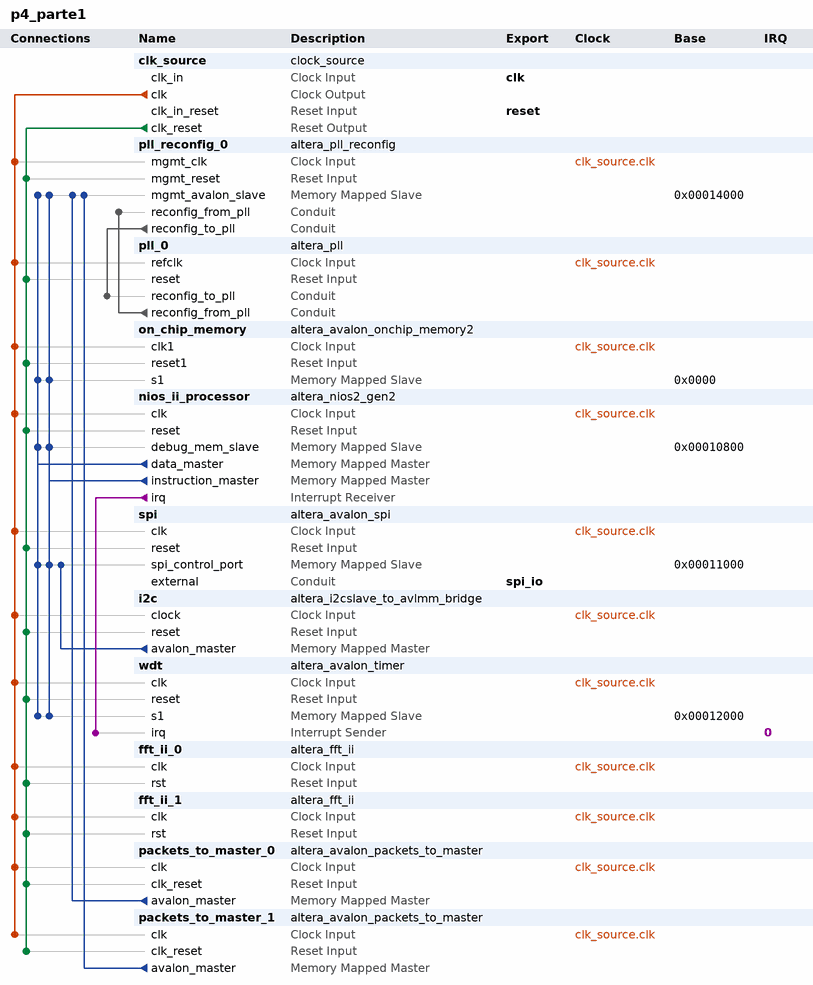
[diagram p0: system contents]
# Platform Designer (Qsys) system p4_parte1, Cyclone V 5CSEMA5F31C6
# Parameters at their usual value, and those the tool derives, are not listed.
package require -exact qsys 16.0
create_system p4_parte1
set_project_property DEVICE_FAMILY {Cyclone V}
set_project_property DEVICE 5CSEMA5F31C6

add_instance clk_source clock_source 16.0
set_instance_parameter_value clk_source clockFrequency 50000000

add_instance pll_reconfig_0 altera_pll_reconfig 16.0

add_instance pll_0 altera_pll 16.0
set_instance_parameter_value pll_0 gui_actual_phase_shift0 {0 ps}
set_instance_parameter_value pll_0 gui_device_speed_grade 1
set_instance_parameter_value pll_0 gui_dsm_out_sel 2nd_order
set_instance_parameter_value pll_0 gui_en_reconf true
set_instance_parameter_value pll_0 gui_fractional_cout 16
set_instance_parameter_value pll_0 gui_number_of_clocks 2
set_instance_parameter_value pll_0 gui_operation_mode direct
set_instance_parameter_value pll_0 gui_output_clock_frequency0 100.0
set_instance_parameter_value pll_0 gui_output_clock_frequency1 100.0
set_instance_parameter_value pll_0 gui_pll_mode {Integer-N PLL}
set_instance_parameter_value pll_0 gui_reference_clock_frequency 50.0
set_instance_parameter_value pll_0 gui_use_locked false

add_instance on_chip_memory altera_avalon_onchip_memory2 16.0
set_instance_parameter_value on_chip_memory dataWidth 16
set_instance_parameter_value on_chip_memory dualPort false
set_instance_parameter_value on_chip_memory initMemContent false
set_instance_parameter_value on_chip_memory initializationFileName onchip_mem.hex
set_instance_parameter_value on_chip_memory memorySize 1024

add_instance nios_ii_processor altera_nios2_gen2 16.0
set_instance_parameter_value nios_ii_processor dcache_size 2048
set_instance_parameter_value nios_ii_processor exceptionSlave on_chip_memory.s1
set_instance_parameter_value nios_ii_processor icache_size 4096
set_instance_parameter_value nios_ii_processor impl Tiny
set_instance_parameter_value nios_ii_processor resetSlave on_chip_memory.s1

add_instance spi altera_avalon_spi 16.0
set_instance_parameter_value spi clockPolarity 0
set_instance_parameter_value spi dataWidth 8
set_instance_parameter_value spi masterSPI true
set_instance_parameter_value spi numberOfSlaves 1
set_instance_parameter_value spi targetClockRate 128000

add_instance i2c altera_i2cslave_to_avlmm_bridge 16.0
set_instance_parameter_value i2c ADDRESS_STEALING 0
set_instance_parameter_value i2c BYTE_ADDRESSING 2
set_instance_parameter_value i2c I2C_SLAVE_ADDRESS 85
set_instance_parameter_value i2c READ_ONLY 0

add_instance wdt altera_avalon_timer 16.0
set_instance_parameter_value wdt alwaysRun true
set_instance_parameter_value wdt fixedPeriod true
set_instance_parameter_value wdt period 30
set_instance_parameter_value wdt periodUnits SEC
set_instance_parameter_value wdt resetOutput true
set_instance_parameter_value wdt snapshot false

add_instance fft_ii_0 altera_fft_ii 16.0
set_instance_parameter_value fft_ii_0 data_flow {Variable Streaming}
set_instance_parameter_value fft_ii_0 data_rep {Fixed Point}
set_instance_parameter_value fft_ii_0 engine_arch {Quad Output}
set_instance_parameter_value fft_ii_0 in_width 8
set_instance_parameter_value fft_ii_0 length 512
set_instance_parameter_value fft_ii_0 out_order {Bit Reverse}
set_instance_parameter_value fft_ii_0 out_width 8
set_instance_parameter_value fft_ii_0 twid_width 8

add_instance fft_ii_1 altera_fft_ii 16.0
set_instance_parameter_value fft_ii_1 data_flow {Variable Streaming}
set_instance_parameter_value fft_ii_1 data_rep {Fixed Point}
set_instance_parameter_value fft_ii_1 engine_arch {Quad Output}
set_instance_parameter_value fft_ii_1 in_width 8
set_instance_parameter_value fft_ii_1 length 512
set_instance_parameter_value fft_ii_1 out_order Natural
set_instance_parameter_value fft_ii_1 out_width 8
set_instance_parameter_value fft_ii_1 twid_width 8

add_instance packets_to_master_0 altera_avalon_packets_to_master 16.0
set_instance_parameter_value packets_to_master_0 EXPORT_MASTER_SIGNALS 0
set_instance_parameter_value packets_to_master_0 FAST_VER 0
set_instance_parameter_value packets_to_master_0 FIFO_DEPTHS 2

add_instance packets_to_master_1 altera_avalon_packets_to_master 16.0
set_instance_parameter_value packets_to_master_1 EXPORT_MASTER_SIGNALS 0
set_instance_parameter_value packets_to_master_1 FAST_VER 0
set_instance_parameter_value packets_to_master_1 FIFO_DEPTHS 2

# connections
add_connection clk_source.clk fft_ii_0.clk clock
add_connection clk_source.clk fft_ii_1.clk clock
add_connection clk_source.clk i2c.clock clock
add_connection clk_source.clk nios_ii_processor.clk clock
add_connection clk_source.clk on_chip_memory.clk1 clock
add_connection clk_source.clk packets_to_master_0.clk clock
add_connection clk_source.clk packets_to_master_1.clk clock
add_connection clk_source.clk pll_0.refclk clock
add_connection clk_source.clk pll_reconfig_0.mgmt_clk clock
add_connection clk_source.clk spi.clk clock
add_connection clk_source.clk wdt.clk clock
add_connection clk_source.clk_reset fft_ii_0.rst reset
add_connection clk_source.clk_reset fft_ii_1.rst reset
add_connection clk_source.clk_reset i2c.reset reset
add_connection clk_source.clk_reset nios_ii_processor.reset reset
add_connection clk_source.clk_reset on_chip_memory.reset1 reset
add_connection clk_source.clk_reset packets_to_master_0.clk_reset reset
add_connection clk_source.clk_reset packets_to_master_1.clk_reset reset
add_connection clk_source.clk_reset pll_0.reset reset
add_connection clk_source.clk_reset pll_reconfig_0.mgmt_reset reset
add_connection clk_source.clk_reset spi.reset reset
add_connection clk_source.clk_reset wdt.reset reset
add_connection i2c.avalon_master spi.spi_control_port avalon
set_connection_parameter_value i2c.avalon_master/spi.spi_control_port baseAddress 0x00011000
add_connection nios_ii_processor.data_master nios_ii_processor.debug_mem_slave avalon
set_connection_parameter_value nios_ii_processor.data_master/nios_ii_processor.debug_mem_slave baseAddress 0x00010800
add_connection nios_ii_processor.data_master on_chip_memory.s1 avalon
set_connection_parameter_value nios_ii_processor.data_master/on_chip_memory.s1 baseAddress 0x0000
add_connection nios_ii_processor.data_master pll_reconfig_0.mgmt_avalon_slave avalon
set_connection_parameter_value nios_ii_processor.data_master/pll_reconfig_0.mgmt_avalon_slave baseAddress 0x00014000
add_connection nios_ii_processor.data_master spi.spi_control_port avalon
set_connection_parameter_value nios_ii_processor.data_master/spi.spi_control_port baseAddress 0x00011000
add_connection nios_ii_processor.data_master wdt.s1 avalon
set_connection_parameter_value nios_ii_processor.data_master/wdt.s1 baseAddress 0x00012000
add_connection nios_ii_processor.instruction_master nios_ii_processor.debug_mem_slave avalon
set_connection_parameter_value nios_ii_processor.instruction_master/nios_ii_processor.debug_mem_slave baseAddress 0x00010800
add_connection nios_ii_processor.instruction_master on_chip_memory.s1 avalon
set_connection_parameter_value nios_ii_processor.instruction_master/on_chip_memory.s1 baseAddress 0x0000
add_connection nios_ii_processor.instruction_master pll_reconfig_0.mgmt_avalon_slave avalon
set_connection_parameter_value nios_ii_processor.instruction_master/pll_reconfig_0.mgmt_avalon_slave baseAddress 0x00014000
add_connection nios_ii_processor.instruction_master spi.spi_control_port avalon
set_connection_parameter_value nios_ii_processor.instruction_master/spi.spi_control_port baseAddress 0x00011000
add_connection nios_ii_processor.instruction_master wdt.s1 avalon
set_connection_parameter_value nios_ii_processor.instruction_master/wdt.s1 baseAddress 0x00012000
add_connection packets_to_master_0.avalon_master pll_reconfig_0.mgmt_avalon_slave avalon
set_connection_parameter_value packets_to_master_0.avalon_master/pll_reconfig_0.mgmt_avalon_slave baseAddress 0x00014000
add_connection packets_to_master_1.avalon_master pll_reconfig_0.mgmt_avalon_slave avalon
set_connection_parameter_value packets_to_master_1.avalon_master/pll_reconfig_0.mgmt_avalon_slave baseAddress 0x00014000
add_connection pll_0.reconfig_from_pll pll_reconfig_0.reconfig_from_pll conduit
add_connection pll_reconfig_0.reconfig_to_pll pll_0.reconfig_to_pll conduit
add_connection nios_ii_processor.irq wdt.irq interrupt
set_connection_parameter_value nios_ii_processor.irq/wdt.irq irqNumber 0

# exported interfaces
add_interface clk clock sink
set_interface_property clk EXPORT_OF clk_source.clk_in
add_interface reset reset sink
set_interface_property reset EXPORT_OF clk_source.clk_in_reset
add_interface spi_io conduit end
set_interface_property spi_io EXPORT_OF spi.external

set_interconnect_requirement {$system} qsys_mm.clockCrossingAdapter HANDSHAKE
set_interconnect_requirement {$system} qsys_mm.enableEccProtection FALSE
set_interconnect_requirement {$system} qsys_mm.insertDefaultSlave FALSE
set_interconnect_requirement {$system} qsys_mm.maxAdditionalLatency 1

save_system p4_parte1.qsys
